# EAGLE design battery_box (EAGLE 6.3)
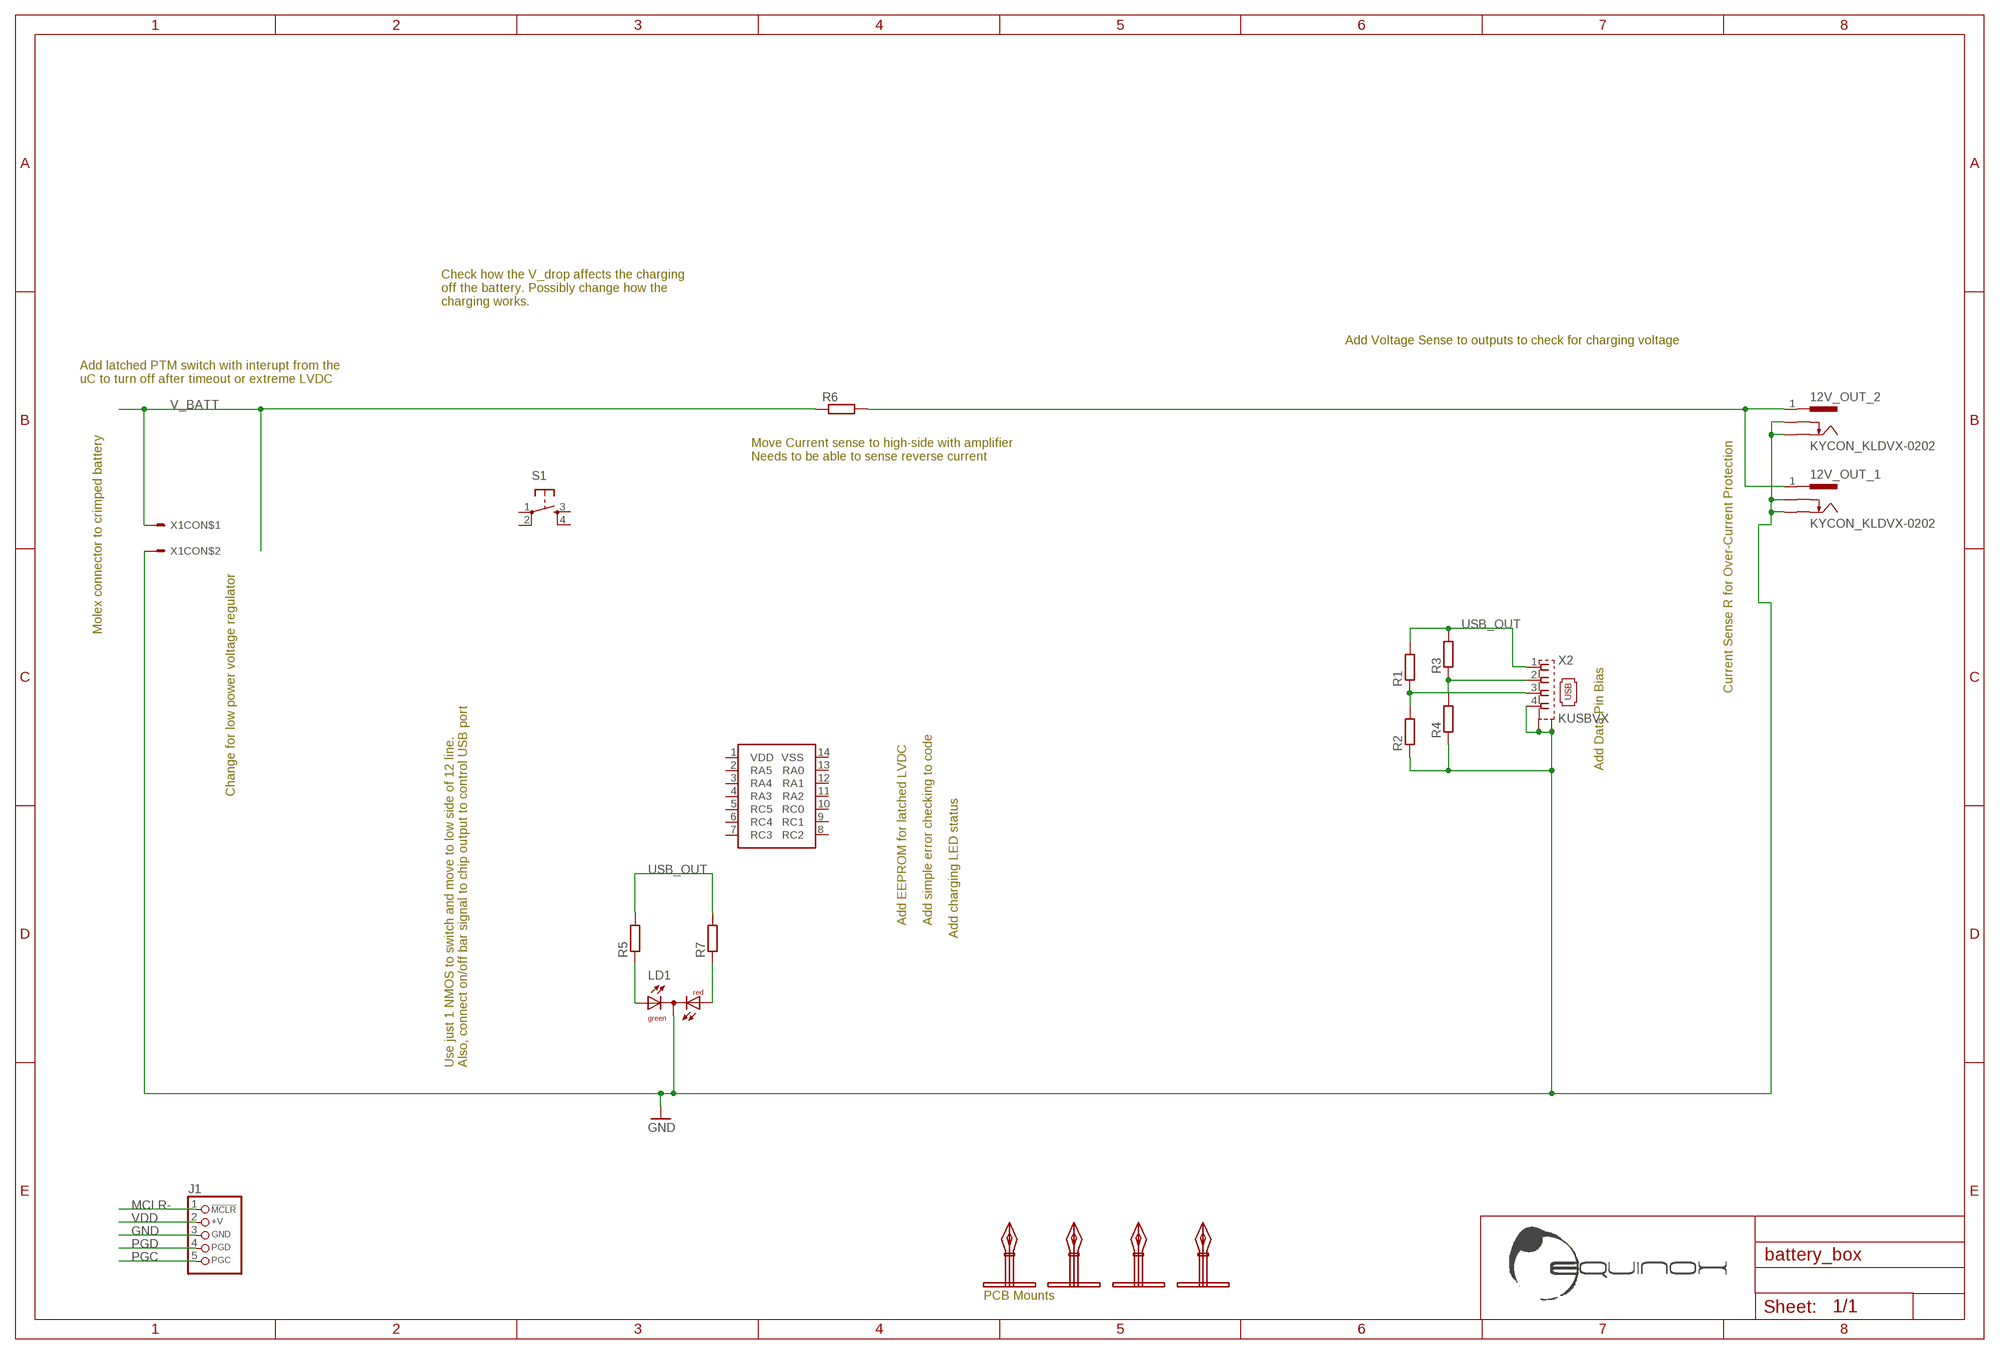
[diagram p0: schematic, sheet 1]

## Parts
12V_OUT_1  KYCON_KLDVX-0202  [KYCON_KLVDX_2020_B]
12V_OUT_2  KYCON_KLDVX-0202  [KYCON_KLVDX_2020_B]
J1  CON_HEADER_PRG_PIC_ICSPA  [HEADER_PRG_1X05]
LD1  DUOLED-RG-C  [DUOLED-C-5MM]
R1  R-EU_R0805  [R0805]
R2  R-EU_R0805  [R0805]
R3  R-EU_R0805  [R0805]
R4  R-EU_R0805  [R0805]
R5  R-EU_R0805  [R0805]
R6  R-EU_R0805  [R0805]
R7  R-EU_R0805  [R0805]
S1  TAC_SWITCHPTH  [TACTILE-PTH]
U$1  EQUINOX_LOGO_LARGE  [EQUINOX_LOGO_LARGE]
U$4  PIC16F1503SOIC  [SO-14]
U$5  PCB_MOUNT_RICHO  [PCBMOUNT]
U$6  PCB_MOUNT_RICHO  [PCBMOUNT]
U$7  PCB_MOUNT_RICHO  [PCBMOUNT]
U$8  PCB_MOUNT_RICHO  [PCBMOUNT]
X1  CON_MOLEX_39_29_1028  [MOLEX_39_29_1028]
X2  KUSBVX  [KUSBVX]

## Nets
GND [power]: 12V_OUT_1.2(PAD2) 12V_OUT_1.3(PAD3) 12V_OUT_2.2(PAD2) 12V_OUT_2.3(PAD3) J1.3(GND) LD1.C R2.1 R4.1 X1.P$2 X2.4 X2.M1(S1) X2.M2(S2)
MCLR-: J1.1(/MCLR)
N$1 [power]: 12V_OUT_1.1(PAD1) 12V_OUT_2.1(PAD1) R6.2
N$2: LD1.AR R7.1
N$3: R1.1 R2.2 X2.3
N$4: LD1.AX(AG) R5.1
N$5: R3.1 R4.2 X2.2
PGC: J1.5(PGC)
PGD: J1.4(PGD)
USB_OUT: R1.2 R3.2 R5.2 R7.2 X2.1
V_BATT [power]: R6.1 X1.P$1
VDD: J1.2(+V)
Unconnected: S1.1 S1.2 S1.3 S1.4 U$4.2(RA5) U$4.3(RA4) U$4.4(RA3) U$4.5(RC5) U$4.6(RC4) U$4.7(RC3) U$4.8(RC2) U$4.9(RC1) U$4.10(RC0) U$4.11(RA2) U$4.12(RA1) U$4.13(RA0)

## Notes on the sheet
- Check how the V_drop affects the charging 
  off the battery. Possibly change how the 
  charging works.
- Add Voltage Sense to outputs to check for charging voltage
- Add latched PTM switch with interupt from the 
  uC to turn off after timeout or extreme LVDC
- Molex connector to crimped battery
- Move Current sense to high-side with amplifier
  Needs to be able to sense reverse current
- Current Sense R for Over-Current Protection
- Add Data Pin Bias
- Change for low power voltage regulator
- Add EEPROM for latched LVDC | Add simple error checking to code
- Add charging LED status
- Use just 1 NMOS to switch and move to low side of 12 line.
  Also, connect on/off bar signal to chip output to control USB port
- PCB Mounts

## Power pins joined to a net without a drawn wire
VDD: U$4.1(VDD)
VSS: U$4.14(VSS)

## Library data of the parts
12V_OUT_1 12V_OUT_2 = equinox:KYCON_KLDVX-0202
J1 = equinox:CON_HEADER_PRG_PIC_ICSP: 5-pin PIC In Circuit Serial Programming header
LD1 = led:DUOLED-RG-C: DUO LED 2 colors (red/green), 5 mm, round, common Cathode www.ligitek.com or other producers.
R1-R7 = rcl:R-EU_: RESISTOR, European symbol
S1 = SparkFun:TAC_SWITCH: Momentary Switch Button commonly used for reset or general input. Spark Fun Electronics SKU : COM-00097
U$1 = equinox:EQUINOX_LOGO_LARGE
U$4 = equinox:PIC16F1503
U$5-U$8 = equinox:PCB_MOUNT_RICHO
X1 = equinox:CON_MOLEX_39_29_1028
X2 = con-kycon:KUSBVX: Vertical,Top Entry Universal Serial Bus Connector KUSBVX Series Source: KYCON Sibalco USB vertical socket KUSBV.pdf

## Net classes
0 default: width 0.381 mm, drill 0.61 mm, clearance 0.381 mm
1 power: width 1.016 mm, drill 0.61 mm, clearance 0.381 mm

## Board
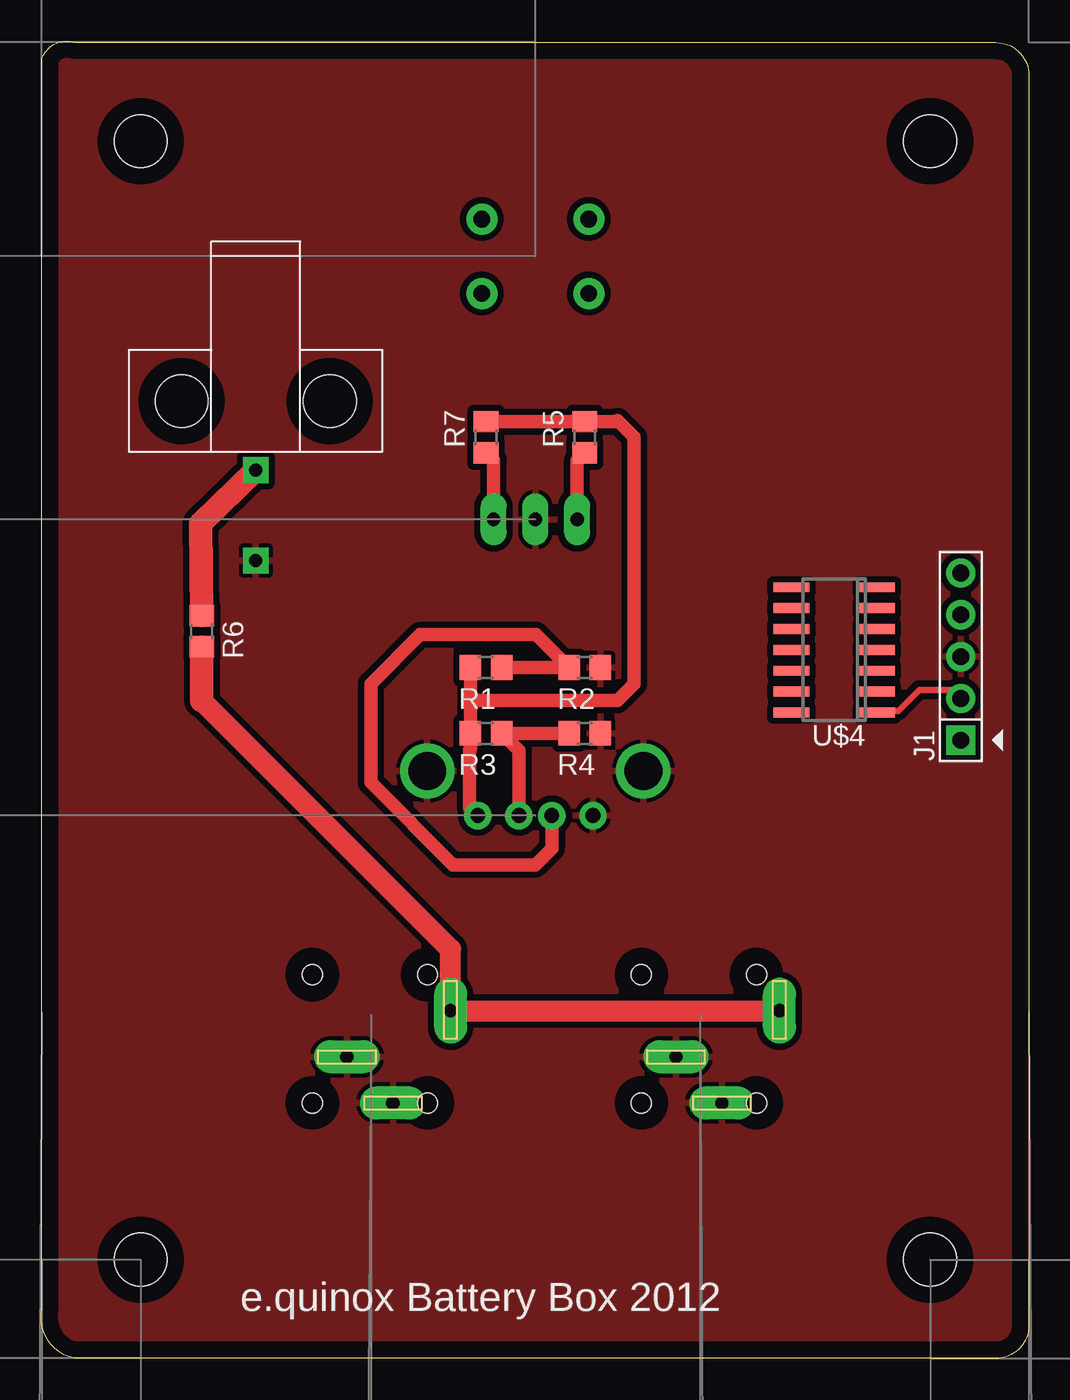
[diagram p1: board, top side]
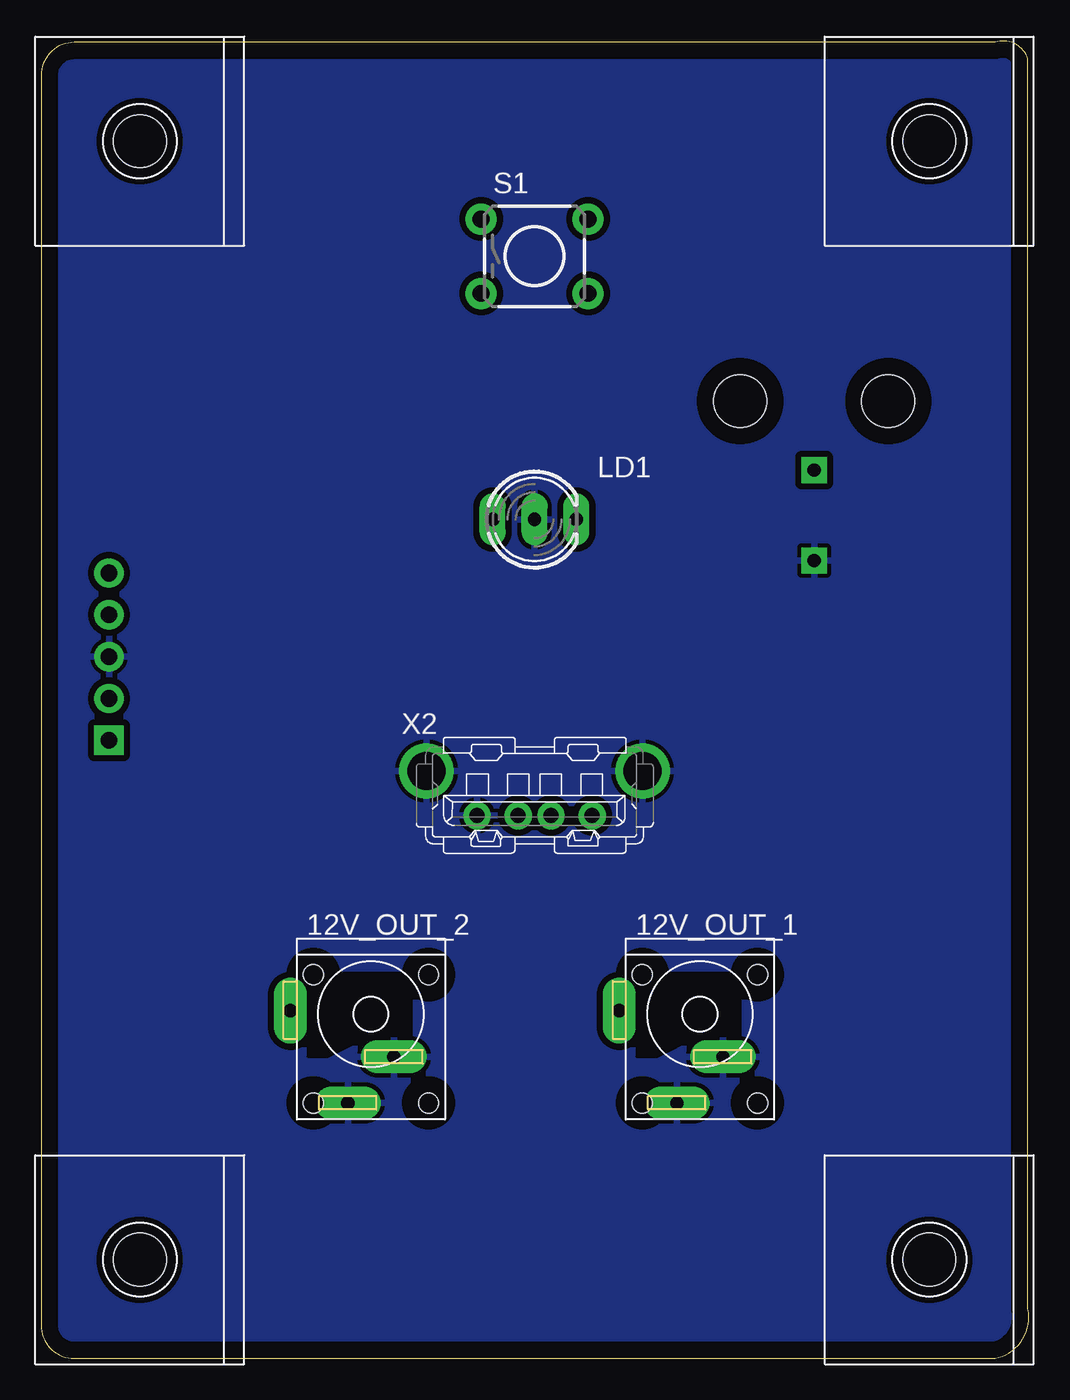
[diagram p2: board, bottom side, seen from below]

Size 60.05 x 80.08 mm. Coordinates in mm from the lower left corner, seen from the top.
Outline: 0.05,3 0.05,79 arc-90 2.05,80 58.05,80 arc-90 60.05,78 60.05,2 arc-90 58.05,0 2.05,0 arc-90 0.05,3
Copper layers (1*16): Top 0.0356mm / dielectric 1.5011mm / Bottom 0.0356mm
Design rules "ee_rules_15mil *": minimum track width 15mil, minimum drill 24mil, track to track 15mil, track to pad 15mil, pad to pad 15mil, via to via 15mil, smd to smd 8mil, copper to edge 40mil, drill to drill 0mil, minimum pad ring 15mil, minimum via ring 15mil, stop-mask expansion 4mil, vias tented up to drill 0mil, thermal gap 10mil

### Footprints (pad centres in the part's own frame; a part is rotated, then mirrored left to right if it is on the bottom)
KYCON_KLVDX_2020_B = drill 0.813 pad 2 long: 1 -4.845,0.25; 2 -1.345,-5.35; 3 1.455,-2.55 | hole 1.2: 3.555,-5.35; -3.445,-5.35; 3.555,2.45; -3.445,2.45
HEADER_PRG_1X05 = drill 1.016 square: 1 -5.08,0 | drill 1.016: 2 -2.54,0; 3 0,0; 4 2.54,0; 5 5.08,0
DUOLED-C-5MM = drill 0.813 long: AR 2.54,0; AX -2.54,0; C 0,0
R0805 = smd 1.3 x 1.5: 1 -0.95,0; 2 0.95,0
TACTILE-PTH = drill 1.016 pad 1.88: 1 -3.251,2.261; 2 3.251,2.261; 3 -3.251,-2.261; 4 3.251,-2.261
SO-14 = smd 0.6 x 2.2: 1 -3.81,-2.6; 2 -2.54,-2.6; 3 -1.27,-2.6; 4 0,-2.6; 5 1.27,-2.6; 6 2.54,-2.6; 7 3.81,-2.6; 8 3.81,2.6; 9 2.54,2.6; 10 1.27,2.6; 11 0,2.6; 12 -1.27,2.6; 13 -2.54,2.6; 14 -3.81,2.6
PCBMOUNT = hole 3.2: 0,0
MOLEX_39_29_1028 = drill 0.8 square: P$1 0,0; P$2 0,5.5 | hole 3.2: 4.5,-4.2; -4.5,-4.2
KUSBVX = drill 0.9 pad 1.3: 1 3.5,0; 2 1,0; 3 -1,0; 4 -3.5,0 | drill 2.3 pad 2.8: M1 -6.57,2.71; M2 6.57,2.71

### Placement (x,y rotation side)
12V_OUT_1  20.05,20.88 0 bottom
12V_OUT_2  40.05,20.88 0 bottom
J1  55.92,42.66 90 top
LD1  30.05,51 0 bottom
R1  27.05,42 180 top
R2  33.05,42 180 top
R3  27.05,38 180 top
R4  33.05,38 180 top
R5  33.05,56 90 top
R6  9.77,44.2 270 top
R7  27.05,56 90 top
S1  30.05,67 0 bottom
U$1  9.05,39 90 top
U$4  48.22,43.07 90 top
U$5  54.05,6 0 bottom
U$6  6.05,6 0 bottom
U$7  54.05,74 0 bottom
U$8  6.05,74 0 bottom
X1  13.05,54 180 top
X2  30.05,33 0 bottom

### Tracks (layer width: path | path; a pad name or v marks a point on that pad's centre or on a via)
GND
  pour Bottom: 0.05,80 60.05,80 60.05,0 0.05,0
  pour Top: 0.05,80 60.05,80 60.05,0 0.05,1
N$1
  Top 1.27: 12V_OUT_2.1 12V_OUT_1.1 24.89,24.88 9.77,40
  Top 1.422: R6.2 9.77,40
N$2
  Top 0.813: LD1.AR 27.51,54.59 R7.1
N$3
  Top 0.813: X2.3 31.05,31 30.05,30 25.05,30 20.05,35 20.05,41 23.05,44 30.1,44 R2.2 R1.1
N$4
  Top 0.813: LD1.AX 32.59,54.59 R5.1
N$5
  Top 0.813: R4.2 R3.1 29.05,36.95 X2.2
USB_OUT
  Top 0.813: 26.1,40 R3.2 26.1,37.05 26.05,37 26.05,33.5 X2.1 | 26.1,40 R1.2 | 26.1,40 35.05,40 36.05,41 36.05,56 35.05,57 35,56.95 R5.2 R7.2
V_BATT
  Top 1.422: R6.1 9.7,50.75 X1.P$1
VDD
  Top 0.381: U$4.1 50.85,39.37 52.12,39.37 53.39,40.64 55.93,40.64 J1.2

### Text on the board
tNames: e.quinox Battery Box 2012